# Altium project DCDC_CHANNEL.PrjPcb
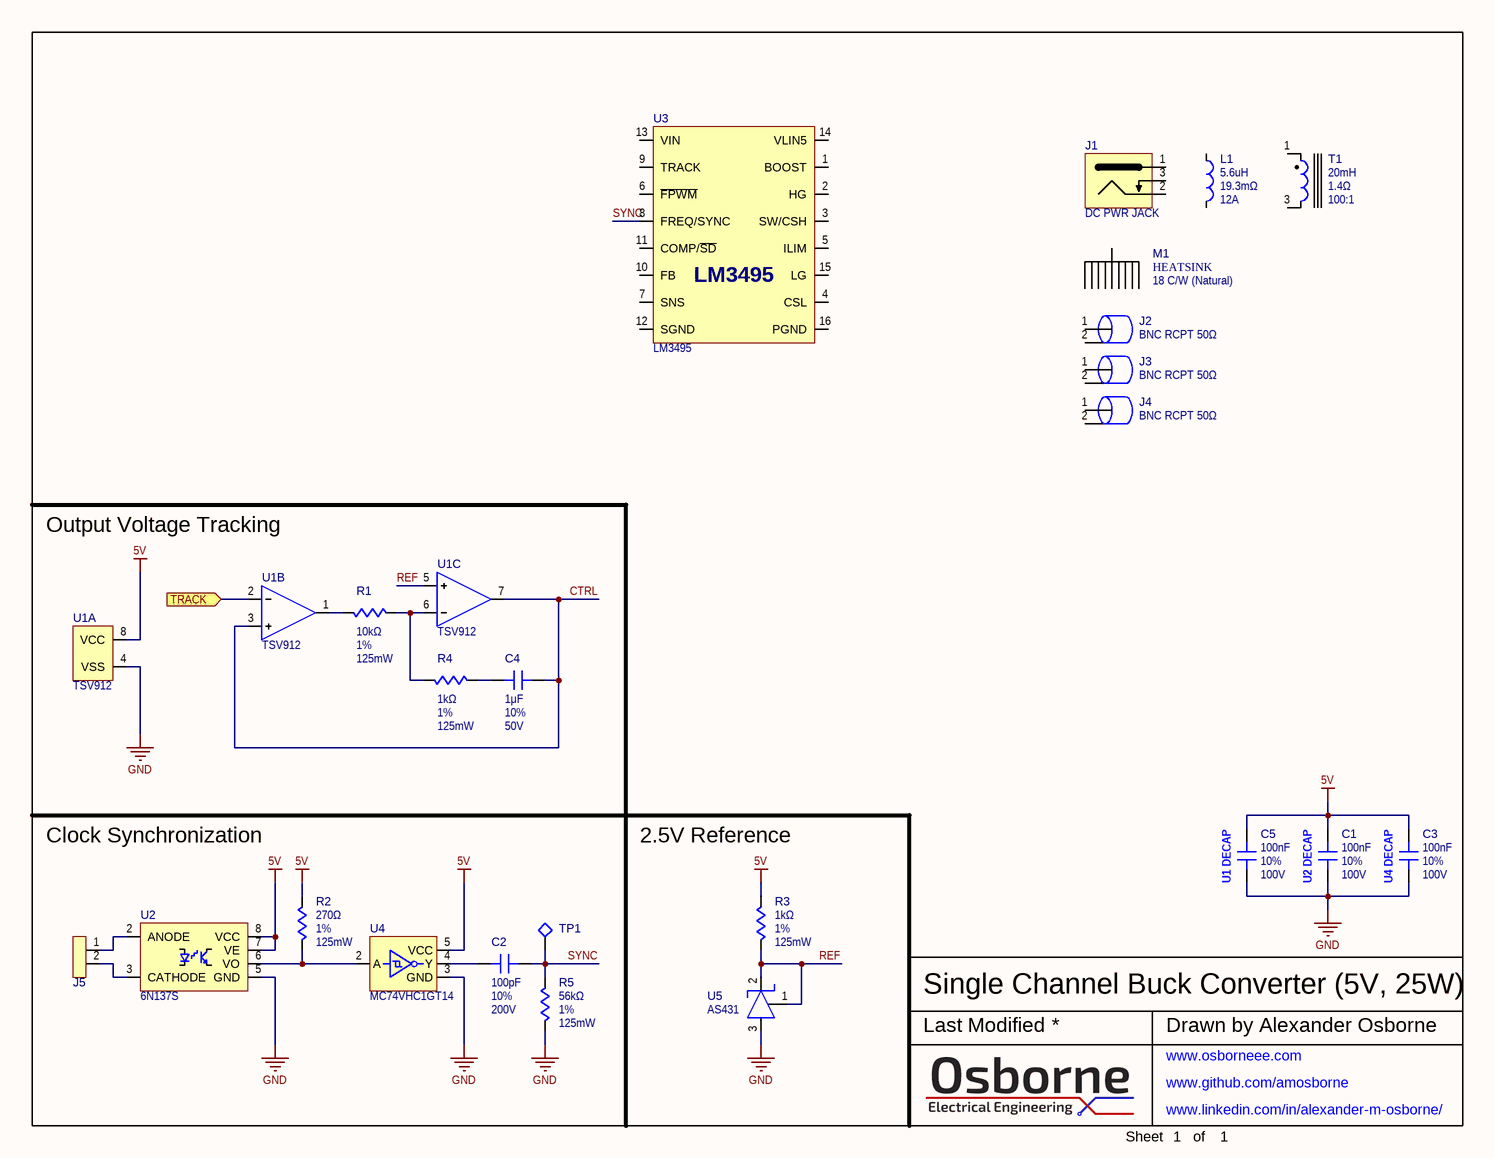
[diagram p0: DCDC_CHANNEL.SchDoc]
1 sheet, 24 parts. Net scope: flat (ports and power ports of the same name join across sheets).

## Sheet DCDC_CHANNEL.SchDoc: Single Channel Buck Converter (5V, 25W)
size Letter; SheetNumber: 1; SheetTotal: 1; ENG_APP_DATE: --/--/--; DSN_APP_DATE: --/--/--; CHK_APP_DATE: --/--/--

### Parts
C1  value 100nF  Voltage: 100V  Tolerance: 10%  (hidden comment: 732-12244-1-ND)
C2  value 100pF  Voltage: 200V  Tolerance: 10%  (hidden comment: 732-12161-1-ND)
C3  value 100nF  Voltage: 100V  Tolerance: 10%  (hidden comment: 732-12244-1-ND)
C4  value 1μF  Voltage: 50V  Tolerance: 10%  (hidden comment: 1276-2928-1-ND)
C5  value 100nF  Voltage: 100V  Tolerance: 10%  (hidden comment: 732-12244-1-ND)
J1  DC PWR JACK
J2  BNC RCPT 50Ω
J3  BNC RCPT 50Ω
J4  BNC RCPT 50Ω
J5  (no value)  (no BOM)
L1  value 5.6uH  Irms: 12A  DCR: 19.3mΩ  (hidden comment: SRP1038C-5R6MCT-ND)
M1  HEATSINK  Theta: 18 C/W (Natural)
R1  value 10kΩ  Tolerance: 1%  Power: 125mW  (hidden comment: RMCF0805FT10K0CT-ND)
R2  value 270Ω  Tolerance: 1%  Power: 125mW  (hidden comment: RMCF0805FT270RCT-ND)
R3  value 1kΩ  Tolerance: 1%  Power: 125mW  (hidden comment: RMCF0805FT1K00CT-ND)
R4  value 1kΩ  Tolerance: 1%  Power: 125mW  (hidden comment: RMCF0805FT1K00CT-ND)
R5  value 56kΩ  Tolerance: 1%  Power: 125mW  (hidden comment: RMCF0805FT56K0CT-ND)
T1  value 20mH  N: 100:1  DCR: 1.4Ω  (hidden comment: 553-1543-ND)
TP1  36-1033-ND  (value not drawn)
U1  TSV912  (parts A,B,C of 3)
U2  6N137S
U3  LM3495
U4  MC74VHC1GT14
U5  AS431

### Ports
TRACK (in)

### Nets
5V: C1.1 C3.1 C5.1 R2.1 R3.1 U1.8(VCC) U2.7(VE) U2.8(VCC) U4.5(VCC)
GND: C1.2 C3.2 C5.2 R5.2 U1.4(VSS) U2.5(GND) U4.3(GND) U5.3(ANODE)
CTRL: C4.1 U1.3(+IN_A) U1.7(OUT_B)
REF: R3.2 U1.5(+IN_B) U5.1(REF) U5.2(CATHODE)
SYNC: C2.2 R5.1 TP1.1 U3.8(FREQ/SYNC)
NetC2_1: C2.1 U4.4(Y)
NetC4_2: C4.2 R4.2
NetJ5_1: J5.1 U2.2(ANODE)
NetJ5_2: J5.2 U2.3(CATHODE)
NetR1_1: R1.1 U1.1(OUT_A)
NetR1_2: R1.2 R4.1 U1.6(-IN_B)
NetR2_2: R2.2 U2.6(VO) U4.2(A)
NetU1_2: U1.2(-IN_A) ; port TRACK

Not connected (* = marked no-connect by the designer): J1 1(9) 2(11) 3(10); J2 1(12) 2(12); J3 1(12) 2(12); J4 1(12) 2(12); L1 1 2; M1 1(8); T1 1 3; U3 1(BOOST) 2(HG) 3(SW/CSH) 4(CSL) 5(ILIM) 6(~{FPWM}) 7(SNS) 9(TRACK) 10(FB) 11(COMP/~{SD}) 12(SGND) 13(VIN) 14(VLIN5) 15(LG) 16(PGND); U4 1(NC)

### Notes on the sheet
- Output Voltage Tracking
- Clock Synchronization
- 2.5V Reference
- (near C5) U1 DECAP
- (near C1) U2 DECAP
- (near C3) U4 DECAP
- Last Modified
- Drawn by Alexander Osborne
- www.osborneee.com <http://www.osborneee.com>
- www.github.com/amosborne <http://www.github.com/amosborne>
- Sheet
- www.linkedin.com/in/alexander-m-osborne/ <http://www.linkedin.com/in/alexander-m-osborne/>
- of

### Library data of the parts
C1 C3 C5 = CAP-CER-100N-10T-100V-0805: CAP, CER, 100nF ±10%, 100V, 0805; Supplier 1: Digi-Key; Supplier Part Number 1: 732-12244-1-ND
C2 = CAP-CER-100P-10T-200V-0805: CAP, CER, 100pF ±10%, 200V, 0805; Supplier 1: Digi-Key; Supplier Part Number 1: 732-12161-1-ND
C4 = CAP-CER-1U00-10T-50V-0805: CAP, CER, 1μF ±10%, 50V, 0805; Supplier 1: Digi-Key; Supplier Part Number 1: 1276-2928-1-ND
J1 = DC-PWR-JACK: DC Power Jack, 48V, 6.5A; Supplier 1: Digi-Key; Supplier Part Number 1: 839-54-00165CT-ND
J2-J4 = BNC-RCPT: BNC Receptacle, 50Ω; Supplier 1: Digi-Key; Supplier Part Number 1: WM5524-ND
J5 = HEADER_1x2: Header 1x2 THT
L1 = IND-5U60-20T0-12A0: IND, 5.6uH ±20.0%, 19.3mΩ DCR, 12A Irms; Supplier 1: Digi-Key; Supplier Part Number 1: SRP1038C-5R6MCT-ND
M1 = HEATSINK: Heatsink, 18C/W @ Natural; Supplier 1: Digi-Key; Supplier Part Number 1: ATS2115-ND
R1 = RES-10K0-1T00-W125-0805: RES, 10kΩ ±1.00%, 125mW, 0805; Supplier 1: Digi-Key; Supplier Part Number 1: RMCF0805FT10K0CT-ND
R2 = RES-270R-1T00-W125-0805: RES, 270Ω ±1.00%, 125mW, 0805; Supplier 1: Digi-Key; Supplier Part Number 1: RMCF0805FT270RCT-ND
R3 R4 = RES-1K00-1T00-W125-0805: RES, 1kΩ ±1.00%, 125mW, 0805; Supplier 1: Digi-Key; Supplier Part Number 1: RMCF0805FT1K00CT-ND
R5 = RES-56K0-1T00-W125-0805: RES, 56kΩ ±1.00%, 125mW, 0805; Supplier 1: Digi-Key; Supplier Part Number 1: RMCF0805FT56K0CT-ND
T1 = XFMR-20M0-100N: XFMR, 20mH, 1.4Ω DCR, 100:1; Supplier 1: Digi-Key; Supplier Part Number 1: 553-1543-ND
TP1 = TEST-POINT: Test Point Loop; Supplier 1: Digi-Key; Supplier Part Number 1: 36-1033-ND
U1 = TSV912: Operational Amplifier, Rail-to-Rail; Supplier 1: Digi-Key; Supplier Part Number 1: 296-47162-1-ND
U2 = 6N137S: High-Speed Optocoupler, 10MBd; Supplier 1: Digi-Key; Supplier Part Number 1: 160-1793-ND
U3 = LM3495: Current Mode Buck Controller; Supplier 1: Digi-Key; Supplier Part Number 1: LM3495MTC/NOPB-ND
U4 = MC74VHC1GT14: Schmitt Trigger Inverter, TTL; Supplier 1: Digi-Key; Supplier Part Number 1: M74VHC1GT14DTT1GOSCT-ND
U5 = AS431: Shunt Voltage Reference, 2.5V, 0.5%; Supplier 1: Digi-Key; Supplier Part Number 1: AS431ANTR-G1DICT-ND